# EAGLE schematic main (EAGLE 6.4)
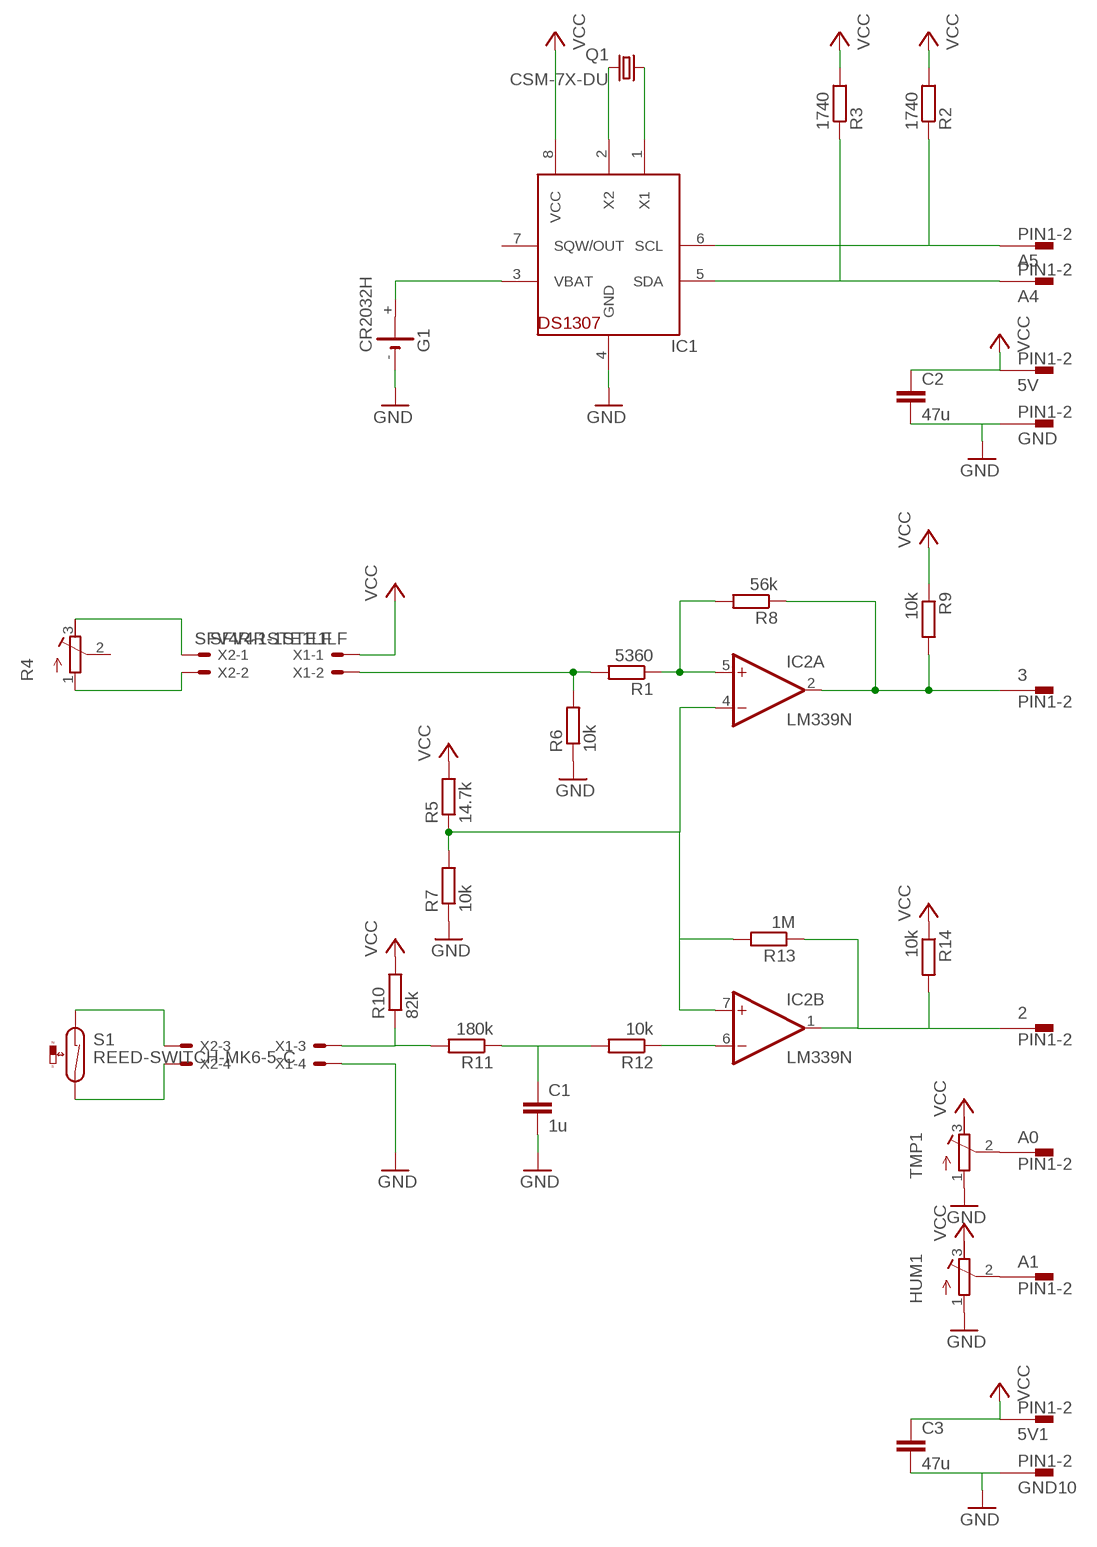
[diagram p0: schematic, sheet 1]

## Parts
2  PIN1-2  [62221]
3  PIN1-2  [62221]
5V  PIN1-2  [62221]
5V1  PIN1-2  [62221]
A0  PIN1-2  [62221]
A1  PIN1-2  [62221]
A4  PIN1-2  [62221]
A5  PIN1-2  [62221]
C1  1u  C2,5-3  [C2.5-3]
C2  47u  C2,5-3  [C2.5-3]
C3  47u  C2,5-3  [C2.5-3]
G1  CR2032H  [CR2032H]
GND  PIN1-2  [62221]
GND10  PIN1-2  [62221]
HUM1  R-TRIMM4G/J  [RTRIM4G/J]
IC1  DS1307  [DIL08]
IC2  LM339N  [DIL14]
Q1  CSM-7X-DU  [CSM-7X-DU]
R1  5360  R-EU_0204/2V  [0204V]
R2  1740  R-EU_0204/2V  [0204V]
R3  1740  R-EU_0204/2V  [0204V]
R4  R-TRIMM4G/J  [RTRIM4G/J]
R5  14.7k  R-EU_0204/2V  [0204V]
R6  10k  R-EU_0204/2V  [0204V]
R7  10k  R-EU_0204/2V  [0204V]
R8  56k  R-EU_0204/2V  [0204V]
R9  10k  R-EU_0204/2V  [0204V]
R10  82k  R-EU_0204/2V  [0204V]
R11  180k  R-EU_0204/2V  [0204V]
R12  10k  R-EU_0204/2V  [0204V]
R13  1M  R-EU_0204/2V  [0204V]
R14  10k  R-EU_0204/2V  [0204V]
S1  REED-SWITCH-MK6-5-C  [MK6-5]
TMP1  R-TRIMM4G/J  [RTRIM4G/J]
X1  SFV4R-1STE1LF  [SFV4R-1STE1LF]
X2  SFV4R-1STE1LF  [SFV4R-1STE1LF]

## Nets
1M: 2.1 IC2.1(B:OUT) R13.1 R14.2
GND: C1.2 C2.2 C3.2 G1.- GND10.1 GND.1 HUM1.1(A) IC1.4(GND) R6.1 R7.1 TMP1.1(A) X1.4
N$1: A5.1 IC1.6(SCL) R2.1
N$2: A4.1 IC1.5(SDA) R3.1
N$3: IC1.1(X1) Q1.1
N$4: IC1.2(X2) Q1.2
N$5: G1.+ IC1.3(VBAT)
N$6: IC2.4(A:-IN) IC2.7(B:+IN) R5.1 R7.2 R13.2
N$7: S1.1 X2.3
N$8: R4.3(E) X2.1
N$9: R4.1(A) X2.2
N$10: R1.2 R6.2 X1.2
N$11: S1.2 X2.4
N$12: 3.1 IC2.2(A:OUT) R8.1 R9.2
N$13: R10.1 R11.2 X1.3
N$14: IC2.5(A:+IN) R1.1 R8.2
N$15: IC2.6(B:-IN) R12.1
N$16: C1.1 R11.1 R12.2
N$17: A0.1 TMP1.2(S)
N$18: A1.1 HUM1.2(S)
VCC: 5V1.1 5V.1 C2.1 C3.1 HUM1.3(E) IC1.8(VCC) R2.2 R3.2 R5.2 R9.1 R10.2 R14.1 TMP1.3(E) X1.1
Unconnected: G1.+@1(+) IC1.7(SQW/OUT) IC2.8(C:-IN) IC2.9(C:+IN) IC2.10(D:-IN) IC2.11(D:+IN) IC2.13(D:OUT) IC2.14(C:OUT) R4.2(S)

## Power pins joined to a net without a drawn wire
GND: IC2.12(P:GND)
V+: IC2.3(P:V+)

## Library data of the parts
2 3 5V 5V1 A0 A1 A4 A5 GND GND10 = con-faston:PIN1-2: CONN TAB FASTON BRASS .187 PCB TAB, FSSTON, DUAL STAKE, .187 SERIES Digi-Key Part Number: A24734CT-ND Source: Tyco Electronics Corporation .. ENG_CD_62221_R.pdf http://search.digikey.com/scripts/DkSearch/dksus.dll?Detail&name=A24734CT-ND; MF: TYCO ELECTRONICS; MPN: 62221-1; OC_FARNELL: unknown; OC_NEWARK: 16H2318
C1-C3 = capacitor-wima:C: CAPACITOR naming: grid - package width
G1 = battery:CR2032H: LI BATTERY Varta
HUM1 R4 TMP1 = rcl:R-TRIMM: Trimm resistor
IC1 = adafruit:DS1307: DS1307 Real time clock (RTC) with battery backup ability. Talk to it via i2c
IC2 = linear:LM339: Low Power Low Offset Voltage Quad Comparators with open collector; LM139/LM239/LM339/LM2901/LM3302
Q1 = crystal:CSM-7X-DU: SMD CRYSTAL Source: www.ecsxtal.com .. Crystal 3.6864MHz CSM_7X_DU.PDF; OC_FARNELL: unknown; OC_NEWARK: unknown
R1-R3 R5-R14 = rcl:R-EU_: RESISTOR, European symbol
S1 = switch-reed:REED-SWITCH-: Reed Sensor; MF: MEDER; MPN: MK6-5-C; OC_FARNELL: 1079480
X1 X2 = adafruit:SFV4R-1STE1LF: FPC Connector ZIF for SMT 0.5mm SFV4R-1STE1LF Useful as the LED backlight connector for a PSP display